# EasyEDA schematic Flight_controller.json
TITLE: Sheet_1; REV: 1.0; Date: 2023-04-23; Sheet: 1/1; Drawn By: suturin_daniil; Company: Your Company
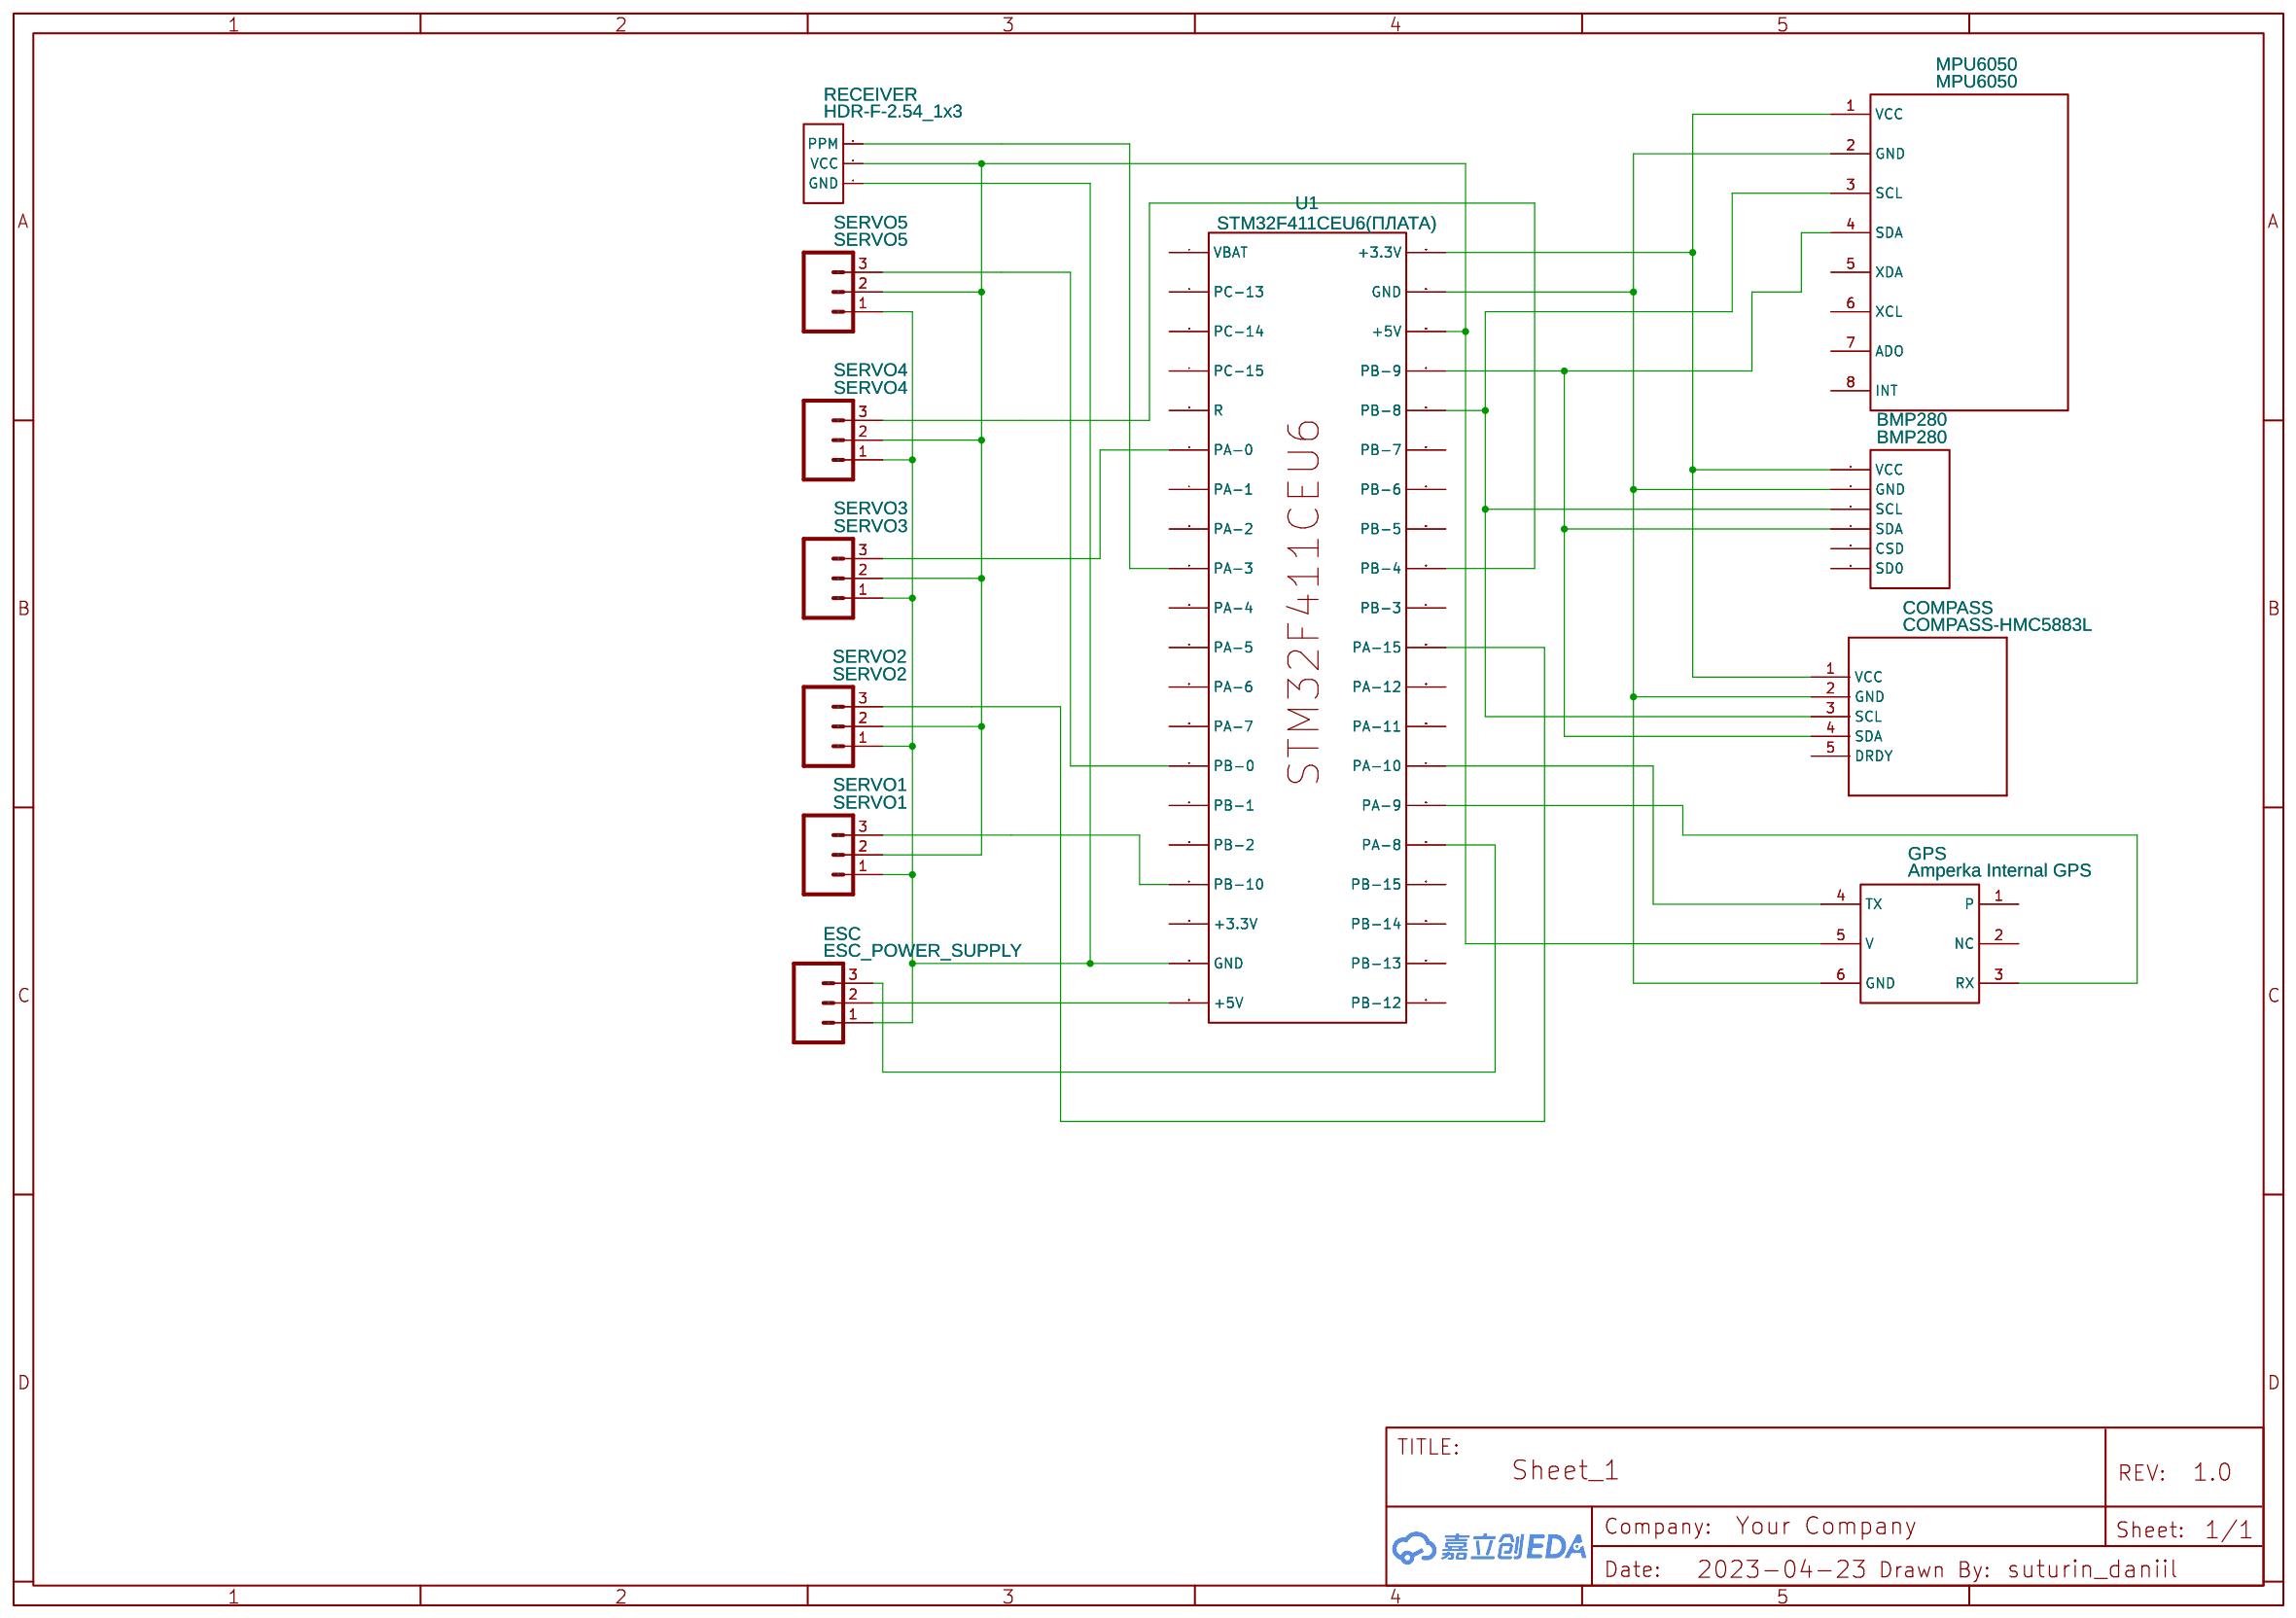
[diagram p0: schematic sheet]

## Parts
BMP280  BMP280  [BMP280(2)]
COMPASS  COMPASS-HMC5883L  [COMPASS-HMC5883L]
ESC  ESC_POWER_SUPPLY  [W-03 2.54]
GPS  Amperka Internal GPS  [AMPERKA TROYKA GPS]
MPU6050  MPU6050  [MPU6050_C]
RECEIVER  HDR-F-2.54_1x3  [HDR-F-2.54_1X3]
SERVO1  SERVO1  [W-03 2.54]
SERVO2  SERVO2  [W-03 2.54]
SERVO3  SERVO3  [W-03 2.54]
SERVO4  SERVO4  [W-03 2.54]
SERVO5  SERVO5  [W-03 2.54]
U1  STM32F411CEU6(ПЛАТА)  [STM32F411CEU6]

## Library data of the parts
BMP280 = BMP280: Contributor: davidalejo0401
COMPASS = COMPASS-HMC5883L: Contributor: vamsi krishna
ESC SERVO1-SERVO4 = BALANCE W-03 (2.54MM): Contributor: xlamzerg
GPS = Amperka Internal GPS: Manufacturer: Amperka; Manufacturer Part: Internal GPS; Contributor: fordmercuryfan
MPU6050 = MPU6050: Contributor: thecvely
RECEIVER = HDR-F-2.54_1x3: Supplier Part: C146690; Supplier: LCSC; Contributor: LCEDA_Lib
SERVO5 = BALANCE W-03 (2.54MM): Contributor: xlamzerg; Package Display: No
U1 = STM32F411CEU6(ПЛАТА): Contributor: sergioermakov

## Nets
Net-(BMP280-1): BMP280.1(VCC) COMPASS.1(VCC) MPU6050.1(VCC) U1.40(+3.3V)
Net-(BMP280-2): BMP280.2(GND) COMPASS.2(GND) GPS.6(GND) MPU6050.2(GND) U1.39(GND)
Net-(BMP280-3): BMP280.3(SCL) COMPASS.3(SCL) MPU6050.3(SCL) U1.36(PB-8)
Net-(BMP280-4): BMP280.4(SDA) COMPASS.4(SDA) MPU6050.4(SDA) U1.37(PB-9)
Net-(ESC-1): ESC.1 RECEIVER.1(GND) SERVO1.1 SERVO2.1 SERVO3.1 SERVO4.1 SERVO5.1 U1.19(GND)
Net-(ESC-2): ESC.2 U1.20(+5V)
Net-(ESC-3): ESC.3 U1.25(PA-8)
Net-(GPS-3): GPS.3(RX) U1.26(PA-9)
Net-(GPS-4): GPS.4(TX) U1.27(PA-10)
Net-(GPS-5): GPS.5(V) RECEIVER.2(VCC) SERVO1.2 SERVO2.2 SERVO3.2 SERVO4.2 SERVO5.2 U1.38(+5V)
Net-(RECEIVER-3): RECEIVER.3(PPM) U1.9(PA-3)
Net-(SERVO1-3): SERVO1.3 U1.17(PB-10)
Net-(SERVO2-3): SERVO2.3 U1.30(PA-15)
Net-(SERVO3-3): SERVO3.3 U1.6(PA-0)
Net-(SERVO4-3): SERVO4.3 U1.32(PB-4)
Net-(SERVO5-3): SERVO5.3 U1.14(PB-0)

Not connected (* = marked no-connect by the designer): BMP280 5(CSD) 6(SD0); COMPASS 5(DRDY); GPS 1(P) 2(NC); MPU6050 5(XDA) 6(XCL) 7(ADO) 8(INT); U1 1(VBAT) 2(PC-13) 3(PC-14) 4(PC-15) 5(R) 7(PA-1) 8(PA-2) 10(PA-4) 11(PA-5) 12(PA-6) 13(PA-7) 15(PB-1) 16(PB-2) 18(+3.3V) 21(PB-12) 22(PB-13) 23(PB-14) 24(PB-15) 28(PA-11) 29(PA-12) 31(PB-3) 33(PB-5) 34(PB-6) 35(PB-7)
